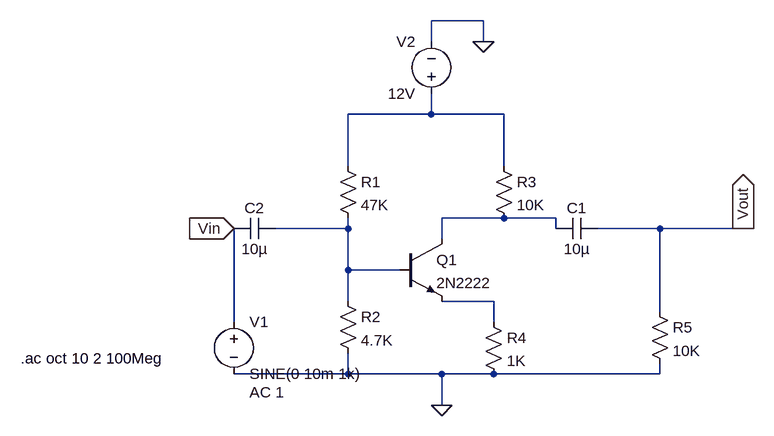
[diagram p0: schematic 3 current series feedback amplifer.asc]
3 current series feedback amplifer.asc, the LTspice schematic file:
Version 4
SHEET 1 880 680
WIRE 208 -208 128 -208
WIRE 128 -176 128 -208
WIRE 208 -176 208 -208
WIRE 128 -64 128 -96
WIRE 128 -64 0 -64
WIRE 240 -64 128 -64
WIRE 0 16 0 -64
WIRE 240 16 240 -64
WIRE 240 96 144 96
WIRE 320 96 240 96
WIRE 0 112 0 96
WIRE 0 112 -112 112
WIRE 320 112 320 96
WIRE 480 112 384 112
WIRE 608 112 480 112
WIRE 624 112 608 112
WIRE 144 128 144 96
WIRE 0 176 0 112
WIRE 80 176 0 176
WIRE 0 224 0 176
WIRE 224 224 144 224
WIRE 480 240 480 112
WIRE -176 256 -176 112
WIRE 224 256 224 224
WIRE 0 336 0 304
WIRE 0 336 -176 336
WIRE 144 336 0 336
WIRE 224 336 144 336
WIRE 480 336 480 320
WIRE 480 336 224 336
WIRE 144 384 144 336
FLAG 144 384 0
FLAG 208 -176 0
FLAG -176 112 Vin
IOPIN -176 112 In
FLAG 608 112 Vout
IOPIN 608 112 Out
SYMBOL npn 80 128 R0
SYMATTR InstName Q1
SYMATTR Value 2N2222
SYMBOL res -16 0 R0
SYMATTR InstName R1
SYMATTR Value 47K
SYMBOL res -16 208 R0
SYMATTR InstName R2
SYMATTR Value 4.7K
SYMBOL cap 384 96 R90
WINDOW 0 0 32 VBottom 2
WINDOW 3 32 32 VTop 2
SYMATTR InstName C1
SYMATTR Value 10µ
SYMBOL cap -112 96 R90
WINDOW 0 0 32 VBottom 2
WINDOW 3 32 32 VTop 2
SYMATTR InstName C2
SYMATTR Value 10µ
SYMBOL res 224 0 R0
SYMATTR InstName R3
SYMATTR Value 10K
SYMBOL res 208 240 R0
SYMATTR InstName R4
SYMATTR Value 1K
SYMBOL voltage -176 240 R0
WINDOW 123 24 124 Left 2
WINDOW 39 0 0 Left 0
SYMATTR InstName V1
SYMATTR Value SINE(0 10m 1k)
SYMATTR Value2 AC 1
SYMBOL voltage 128 -80 R180
WINDOW 0 24 96 Left 2
WINDOW 3 24 16 Left 2
WINDOW 123 0 0 Left 0
WINDOW 39 0 0 Left 0
SYMATTR InstName V2
SYMATTR Value 12V
SYMBOL res 464 224 R0
SYMATTR InstName R5
SYMATTR Value 10K
TEXT -504 312 Left 2 !.ac oct 10 2 100Meg

The netlist it stands for:
* 3 current series feedback amplifer.asc
Q1 N002 N003 N004 0 2N2222
R1 N001 N003 47K
R2 N003 0 4.7K
C1 Vout N002 10µ
C2 N003 Vin 10µ
R3 N001 N002 10K
R4 N004 0 1K
V1 Vin 0 SINE(0 10m 1k) AC 1
V2 N001 0 12V
R5 Vout 0 10K
.model NPN NPN
.model PNP PNP
.lib standard.bjt
.ac oct 10 2 100Meg
.backanno
.end